# Altium schematic sheet ChargingSystem.SchDoc
size A
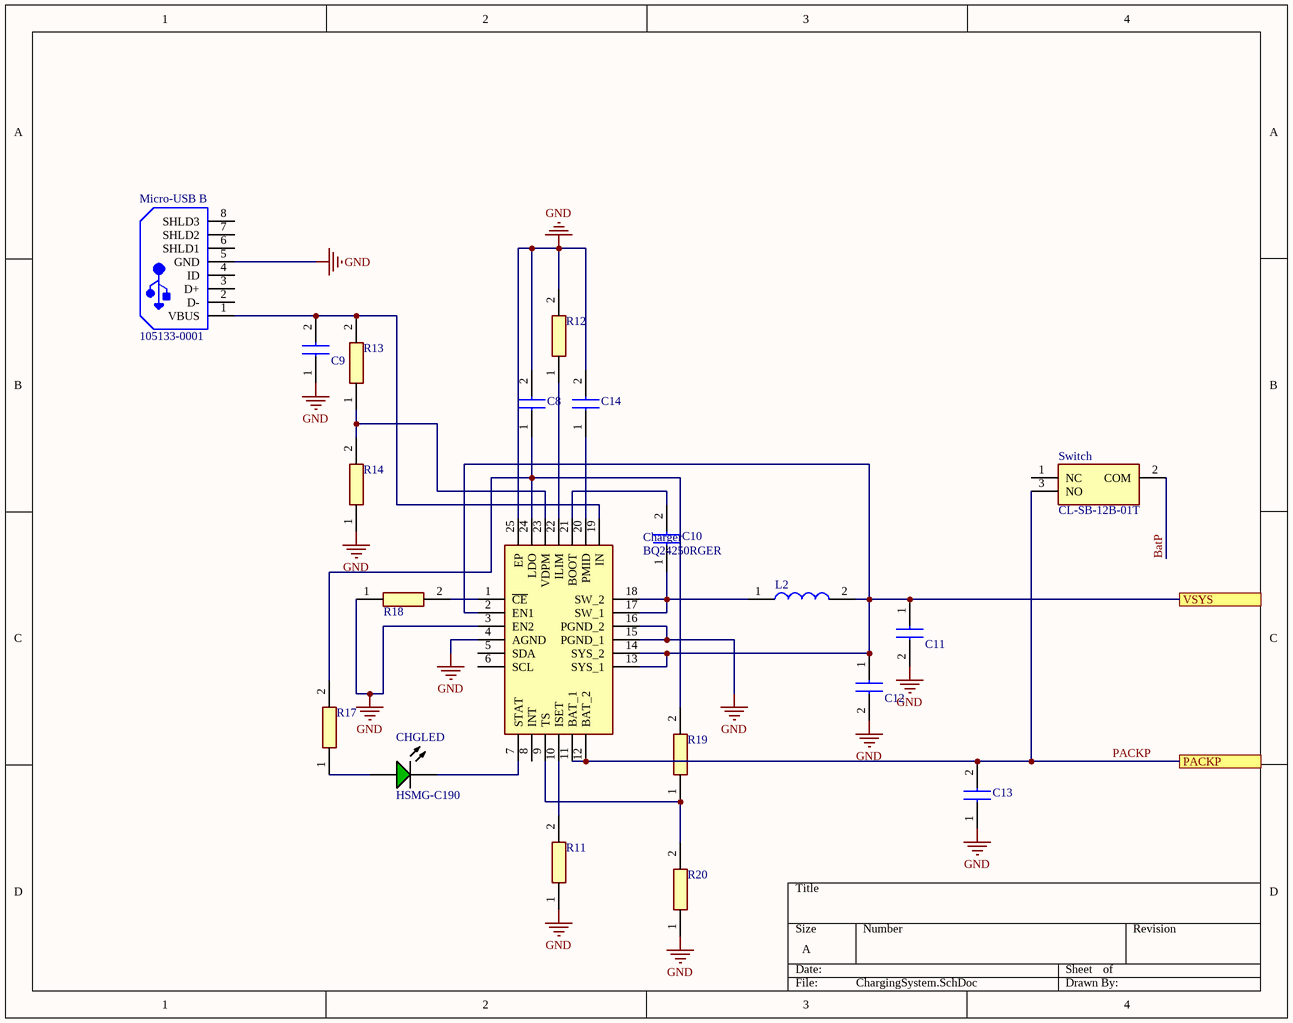
[diagram p0: ChargingSystem.SchDoc]

## Parts
C8  C0603C150K5GAC  [CAPC1608X87N]  (value not drawn)
C9  C0603C150K5GAC  [CAPC1608X87N]  (value not drawn)
C10  C0603C150K5GAC  [CAPC1608X87N]  (value not drawn)
C11  C0603C150K5GAC  [CAPC1608X87N]  (value not drawn)
C12  C0603C150K5GAC  [CAPC1608X87N]  (value not drawn)
C13  C0603C150K5GAC  [CAPC1608X87N]  (value not drawn)
C14  C0603C150K5GAC  [CAPC1608X87N]  (value not drawn)
Charger  BQ24250RGER  [QFN50P400X400X100-25N-D]
CHGLED  HSMG-C190  [AVAG-HSMX-C190_V]
L2  0603CS-47NXGLU  [0603CS82NXGLW]  (value not drawn)
Micro-USB_B  105133-0001  [MOLX-105133-0001_V]
R11  CRCW06034K70JNEA  [RESC1608X50N]  (value not drawn)
R12  CRCW06034K70JNEA  [RESC1608X50N]  (value not drawn)
R13  CRCW06034K70JNEA  [RESC1608X50N]  (value not drawn)
R14  CRCW06034K70JNEA  [RESC1608X50N]  (value not drawn)
R17  CRCW06034K70JNEA  [RESC1608X50N]  (value not drawn)
R18  CRCW06034K70JNEA  [RESC1608X50N]  (value not drawn)
R19  CRCW06034K70JNEA  [RESC1608X50N]  (value not drawn)
R20  CRCW06034K70JNEA  [RESC1608X50N]  (value not drawn)
Switch  CL-SB-12B-01T  [CLSB12B01T]

## Ports
PACKP, VSYS

## Nets
GND: C8.2 C9.1 C11.2 C12.2 C13.1 C14.2 Charger.3(EN2) Charger.4(AGND) Charger.15(PGND_1) Charger.16(PGND_2) Charger.25(EP) Micro-USB_B.5(GND) R11.1 R12.2 R14.1 R18.1 R20.1
BatP: Switch.2(COM)
PACKP: C13.2 Charger.11(BAT_1) Charger.12(BAT_2) Switch.3(NO) ; port PACKP
VSYS: C11.1 C12.1 Charger.2(EN1) Charger.13(SYS_1) Charger.14(SYS_2) L2.2 ; port VSYS
NetC8_1: C8.1 Charger.24(LDO) R17.2 R19.2
NetC9_2: C9.2 Charger.19(IN) Micro-USB_B.1(VBUS) R13.2
NetC10_1: C10.1 Charger.17(SW_1) Charger.18(SW_2) L2.1
NetC10_2: C10.2 Charger.21(BOOT)
NetC14_1: C14.1 Charger.20(PMID)
NetCharger_1: Charger.1(~{CE}) R18.2
NetCharger_7: Charger.7(STAT) CHGLED.2(K)
NetCharger_9: Charger.9(TS) R19.1 R20.2
NetCharger_10: Charger.10(ISET) R11.2
NetCharger_22: Charger.22(ILIM) R12.1
NetCharger_23: Charger.23(VDPM) R13.1 R14.2
NetCHGLED_1: CHGLED.1(A) R17.1

Not connected (* = marked no-connect by the designer): Charger 5(SDA) 6(SCL) 8(INT); Micro-USB_B 2(D-) 3(D+) 4(ID) 6(SHLD1) 7(SHLD2) 8(SHLD3); Switch 1(NC)

## Library data of the parts
C8-C14 = C0603C150K5GAC: Capacitor; Manufacturer_Name: Kemet; Datasheet Link: https://content.kemet.com/datasheets/KEM_C1003_C0G_SMD.pdf; Height: 0.87mm; Manufacturer_Part_Number: C0603C150K5GAC; Mouser Part Number: 80-C0603C150K5GAC; Mouser Price/Stock: https://www.mouser.co.uk/ProductDetail/KEMET/C0603C150K5GAC?qs=Zjfhvh7dXTMDnIuVVWtUUQ%3D%3D
Charger = BQ24250RGER: Integrated Circuit; Manufacturer_Name: Texas Instruments; Datasheet Link: http://www.ti.com/lit/gpn/BQ24250; Height: 1mm; Manufacturer_Part_Number: BQ24250RGER; Arrow Part Number: BQ24250RGER; Arrow Price/Stock: https://www.arrow.com/en/products/bq24250rger/texas-instruments; Mouser Part Number: 595-BQ24250RGER; Mouser Price/Stock: https://www.mouser.co.uk/ProductDetail/Texas-Instruments/BQ24250RGER?qs=VqERlb%252BKohfBI76g9iGg8g%3D%3D
CHGLED = CMP-1744-00002-1: Chip LED, Green, 2.2 V, -40 to 85 degC, 2-Pin SMD, RoHS, Tape and Reel; Frequency: 400 KHz; Max Supply Voltage: 5.5 V; Access Time: 3500 ns; Clock Frequency: 100 KHz; Case\Package: SOIC; Density: 32 kb; Nominal Supply Current: 2 mA; Interface: Serial; Min Supply Voltage: 1.7 V; Packaging: Tape and Reel; PackageReference: HSMX-C190; ComponentLink2URL: http://docs.avagotech.com/docs/AV02-0551EN; RoHSCompliant: true; Pins: 8; REACH SVHC: No SVHC; Max Operating Temperature: 85 degC; Width: 4 mm; Radiation Hardening: No; Package Quantity: 3000; ComponentLink3Description: Package Specification; ComponentLink1Description: Manufacturer URL; Min Operating Temperature: -40 degC; PackageDescription: 2-Pin Surface Mount Device, Body 1.6 x 0.8 mm, Height 0.9 mm; Max Clock Frequency: 100 KHz; Height: 1.5 mm; ComponentLink1URL: http://www.avagotech.com/; DatasheetVersion: Mar-12; ComponentLink2Description: Datasheet; Mount: Surface Mount; Length: 5 mm; ComponentLink3URL: http://www.fairchildsemi.com/dwg/MA/MA03D.pdf
L2 = 0603CS-47NXGLU: Inductor; Manufacturer_Name: COILCRAFT; Datasheet Link: https://www.coilcraft.com/pdfs/0603cs.pdf; Height: 1mm; Manufacturer_Part_Number: 0603CS-47NXGLU; Mouser Part Number: 994-0603CS-47NXGLU; Mouser Price/Stock: https://www.mouser.com/Search/Refine.aspx?Keyword=994-0603CS-47NXGLU
Micro-USB_B = CMP-2000-05829-1: Micro-USB B Receptacle, Vertical, -30 to 85 degC, 5-Pin SMD, RoHS, Tape and Reel; Manufacturer: Molex; Package Version: Rev. C, 11/2015; Voltage Rating: 30VAC; Connector Type: MicroUSBTypeBReceptacle; Current Rating: 1.8A; Number of Ports: 1; Voltage - Max: 30V; Mounting Style: SMD/SMT; Packaging: Reel; Product: MicroUSBTypeBConnectors; Contact Plating: Gold; Flammability Rating: UL94V-0; Package Description: 5-Pin Surface Mount Device, Pitch 0.65 mm; Package Reference: 105133-0001; Contact Material: CopperAlloy; Mounting Angle: Vertical; RoHS: Details; Manufacturer URL: http://www.molex.com/; Factory Pack Quantity: 6000; PartNumber: 105133-0001; Standard: USB; Brand: Molex; Series: 105133; Product Category: USBConnectors; Termination Style: SolderTail; Gender: Receptacle; Package URL: http://www.molex.com/pdm_docs/sd/1051330001_sd.pdf; Datasheet Version: 03/2016; Color: Black; Datasheet URL: http://www.molex.com/webdocs/datasheets/pdf/en-us/1051330001_IO_CONNECTORS.pdf; Mounting Technology: SurfaceMount
R11-R14 R17-R20 = CRCW06034K70JNEA: Resistor; Manufacturer_Name: Vishay; Datasheet Link: http://www.vishay.com/docs/20035/dcrcwe3.pdf; Height: 0.5mm; Manufacturer_Part_Number: CRCW06034K70JNEA; Arrow Part Number: CRCW06034K70JNEA; Arrow Price/Stock: https://www.arrow.com/en/products/crcw06034k70jnea/vishay; Mouser Part Number: 71-CRCW0603J-4.7K-E3; Mouser Price/Stock: https://www.mouser.co.uk/ProductDetail/Vishay-Dale/CRCW06034K70JNEA?qs=C0xaqriB68jbLUpBrIbing%3D%3D
Switch = CL-SB-12B-01T: Switch; Manufacturer_Name: Copal Electronics; Datasheet Link: https://www.nidec-copal-electronics.com/e/catalog/switch/cl-sb.pdf; Height: 5mm; Manufacturer_Part_Number: CL-SB-12B-01T